# Altium schematic sheet USB_POWER.SchDoc
size Letter; SheetNumber: 12; SheetTotal: 15
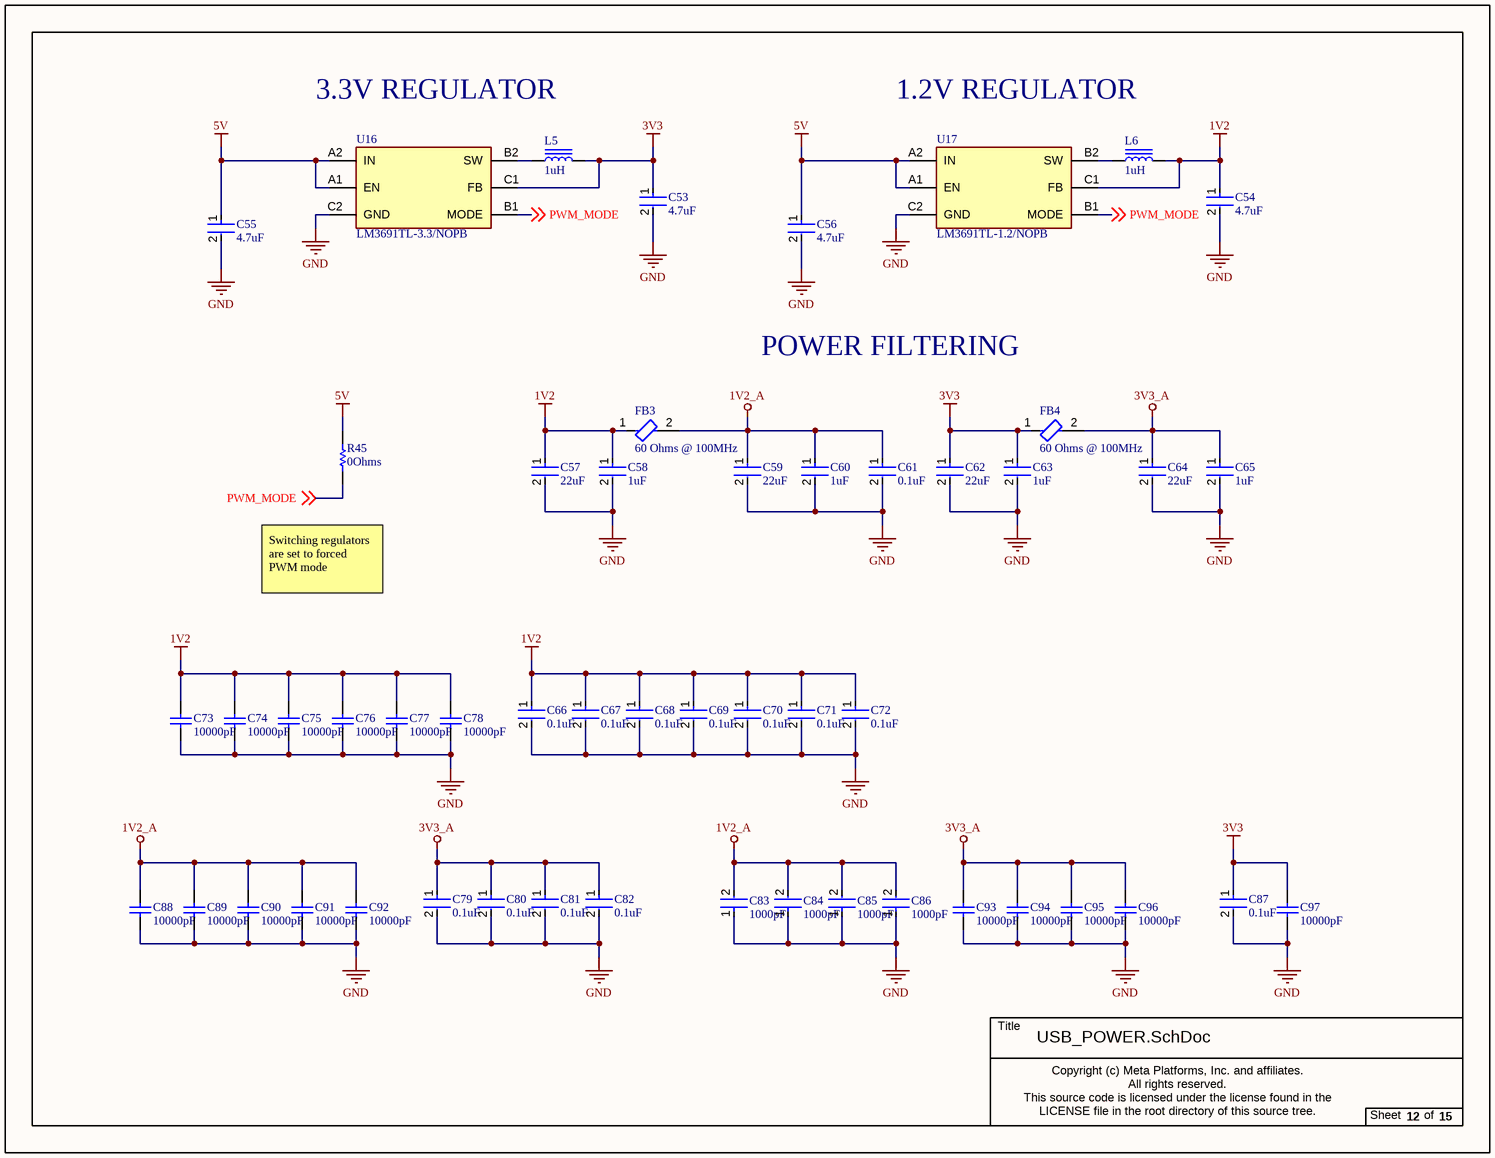
[diagram p0: USB_POWER.SchDoc]

## Parts
C53  4.7uF  [FP-CL828-IPC_C]
C54  4.7uF  [FP-CL828-IPC_C]
C55  4.7uF  [FP-CL828-IPC_C]
C56  4.7uF  [FP-CL828-IPC_C]
C57  22uF  [FP-CL05A226MQ5N6J8-IPC_C]
C58  1uF  [FP-CL511-IPC_C]
C59  22uF  [FP-CL05A226MQ5N6J8-IPC_C]
C60  1uF  [FP-CL511-IPC_C]
C61  0.1uF  [FP-CC0201-BA-MFG]
C62  22uF  [FP-CL05A226MQ5N6J8-IPC_C]
C63  1uF  [FP-CL511-IPC_C]
C64  22uF  [FP-CL05A226MQ5N6J8-IPC_C]
C65  1uF  [FP-CL511-IPC_C]
C66  0.1uF  [FP-CC0201-BA-MFG]
C67  0.1uF  [FP-CC0201-BA-MFG]
C68  0.1uF  [FP-CC0201-BA-MFG]
C69  0.1uF  [FP-CC0201-BA-MFG]
C70  0.1uF  [FP-CC0201-BA-MFG]
C71  0.1uF  [FP-CC0201-BA-MFG]
C72  0.1uF  [FP-CC0201-BA-MFG]
C73  10000pF  [CAPC1005X55X25LL05T10]
C74  10000pF  [CAPC1005X55X25LL05T10]
C75  10000pF  [CAPC1005X55X25LL05T10]
C76  10000pF  [CAPC1005X55X25LL05T10]
C77  10000pF  [CAPC1005X55X25LL05T10]
C78  10000pF  [CAPC1005X55X25LL05T10]
C79  0.1uF  [FP-CC0201-BA-MFG]
C80  0.1uF  [FP-CC0201-BA-MFG]
C81  0.1uF  [FP-CC0201-BA-MFG]
C82  0.1uF  [FP-CC0201-BA-MFG]
C83  1000pF  [FP-C0402-BB-MFG]
C84  1000pF  [FP-C0402-BB-MFG]
C85  1000pF  [FP-C0402-BB-MFG]
C86  1000pF  [FP-C0402-BB-MFG]
C87  0.1uF  [FP-CC0201-BA-MFG]
C88  10000pF  [CAPC1005X55X25LL05T10]
C89  10000pF  [CAPC1005X55X25LL05T10]
C90  10000pF  [CAPC1005X55X25LL05T10]
C91  10000pF  [CAPC1005X55X25LL05T10]
C92  10000pF  [CAPC1005X55X25LL05T10]
C93  10000pF  [CAPC1005X55X25LL05T10]
C94  10000pF  [CAPC1005X55X25LL05T10]
C95  10000pF  [CAPC1005X55X25LL05T10]
C96  10000pF  [CAPC1005X55X25LL05T10]
C97  10000pF  [CAPC1005X55X25LL05T10]
FB3  60 Ohms @ 100MHz  [FP-BLM15-0_05-d0_7-IPC_B]
FB4  60 Ohms @ 100MHz  [FP-BLM15-0_05-d0_7-IPC_B]
L5  1uH  [IND 0603_1608 RF WW]
L6  1uH  [IND 0603_1608 RF WW]
R45  0Ohms  [RESC1005X40X25ML05T10]
U16  LM3691TL-3.3/NOPB  [YZR0006APAF]
U17  LM3691TL-1.2/NOPB  [YZR0006APAF]

## Nets
1V2: C54.1 C57.1 C58.1 C66.1 C67.1 C68.1 C69.1 C70.1 C71.1 C72.1 C73.2 C74.2 C75.2 C76.2 C77.2 C78.2 FB3.1 L6.2 U17.C1(FB)
1V2_A: C59.1 C60.1 C61.1 C83.2 C84.2 C85.2 C86.2 C88.2 C89.2 C90.2 C91.2 C92.2 FB3.2
3V3: C53.1 C62.1 C63.1 C87.1 C97.2 FB4.1 L5.2 U16.C1(FB)
3V3_A: C64.1 C65.1 C79.1 C80.1 C81.1 C82.1 C93.2 C94.2 C95.2 C96.2 FB4.2
5V: C55.1 C56.1 R45.1 U16.A1(EN) U16.A2(IN) U17.A1(EN) U17.A2(IN)
GND: C53.2 C54.2 C55.2 C56.2 C57.2 C58.2 C59.2 C60.2 C61.2 C62.2 C63.2 C64.2 C65.2 C66.2 C67.2 C68.2 C69.2 C70.2 C71.2 C72.2 C73.1 C74.1 C75.1 C76.1 C77.1 C78.1 C79.2 C80.2 C81.2 C82.2 C83.1 C84.1 C85.1 C86.1 C87.2 C88.1 C89.1 C90.1 C91.1 C92.1 C93.1 C94.1 C95.1 C96.1 C97.1 U16.C2(GND) U17.C2(GND)
PWM_MODE: R45.2 U16.B1(MODE) U17.B1(MODE) ; off-sheet PWM_MODE
NetL5_1: L5.1 U16.B2(SW)
NetL6_1: L6.1 U17.B2(SW)

## Notes on the sheet
- 3.3V REGULATOR
- 1.2V REGULATOR
- POWER FILTERING
- Switching regulators
  are set to forced PWM mode
- Title
- Copyright (c) Meta Platforms, Inc. and affiliates.
  All rights reserved.
  This source code is licensed under the license found in the
  LICENSE file in the root directory of this source tree.
- Sheet
- of

## Library data of the parts
C53-C56 = CMP-13271-001251-1: Cap Ceramic 4.7uF 10V X5R ±10% SMD 0402 +85°C Paper T/R; Height: 0.5mm; Mount: Surface Mount; Case Code (Metric): 1005; Case/Package: 0402; Capacitance: 4.7uF; Packaging: Tape and Reel; Dielectric: X5R; Radiation Hardening: No; Material: Ceramic; Thickness: 0.022inch; Min Operating Temperature: -55°C; Voltage Rating: 10V; Case Code (Imperial): 0402; Width: 0.02inch; Length: 1mm; Max Operating Temperature: 85°C; Lead Free: Lead Free; Tolerance: 10%; Package Quantity: 1; Depth: 0.5mm
C57 C59 C62 C64 = CMP-13271-000001-1: CAP CER 22UF 6.3V X5R 0402; Manufacturer Part Number: CL05A226MQ5N6J8; Manufacturer: Samsung Electro-Mechanics; Material: Ceramic; Temperature Coefficient: 15%; Tolerance: 20%; Ipc Land Pattern Name: CAPC10050X50; Lead Free: Yes; Temperature Characteristic: X5R; Temperature: -55°C to +85°C; RoHS: TRUE; ComponentLink2Description: Datasheet; Device Class L3: Ceramic Capacitors; Device Class L1: Passive Components; Value: 22uF; Temperature Range High: +85°C; Automotive: No; Voltage Rating: 6.3V; Package: 0402; Category: Cap; Device Class L2: Capacitors; Height: 0.55mm; ComponentLink2URL: http://www.samsungsem.com/kr/support/library/product-catalog/__icsFiles/afieldfile/2018/11/28/MLCC.pdf; Temperature Range Low: -55°C; Octopart: https://octopart.com/cl05a226mq5n6j8-samsung-82337113; Capacitance: 22uF; Digikey Description: CAP CER 22UF 6.3V X5R 0402
C58 C60 C63 C65 = CMP-13271-001936-1: Cap Ceramic 1uF 10V X5R ±10% SMD 0402 +85°C Paper T/R; Depth: 0.5mm; Case Code (Imperial): 0402; Material: Ceramic; Mount: Surface Mount; Thickness: 0.022inch; Dielectric: X5R; Capacitance: 1uF; Radiation Hardening: No; Case/Package: 0402; Length: 1mm; Tolerance: 10%; Max Operating Temperature: 85°C; Package Quantity: 1; Width: 0.02inch; Voltage Rating: 10V; Contact Plating: Tin; Height: 0.5mm; Min Operating Temperature: -55°C; Case Code (Metric): 1005; Packaging: Tape and Reel
C61 C66-C72 C79-C82 C87 = CMP-03422-000376-1: CAP CER 0.1UF 6.3V X5R 0201; Manufacturer: Yageo; Manufacturer Part Number: CC0201KRX5R5BB104; Tolerance: 0.1; Temperature Coefficient: 15%; Value: 100 nF; Material: Ceramic; Automotive: No; Device Class L2: Capacitors; Temperature Range High: +85°C; Capacitance: 100 nF; Temperature: -55°C to +85°C; ComponentLink2URL: http://www.yageo.com/documents/recent/UPY-GPHC_X5R_4V-to-50V_25.pdf; Category: Cap; Mouser Description: Multilayer Ceramic Capacitors MLCC - SMD/SMT 100nF 6.3V X5R 10%; Ipc Land Pattern Name: CAPC6030X30; Temperature Characteristic: X5R; Voltage Rating: 6.3 V; Lead Free: Yes; Digikey Description: CAP CER 0.1UF 6.3V X5R 0201; Device Class L1: Passive Components; Octopart: https://octopart.com/cc0201krx5r5bb104-yageo-9292636; Height: 0.33mm; Package: CC0201-BA; Footprint Url: http://www.yageo.com/exep/pages/download/literatures/UPY-C_GEN_24.pdf; ComponentLink2Description: Datasheet; Device Class L3: Ceramic Capacitors; Temperature Range Low: -55°C; RoHS: TRUE
C73-C78 C88-C97 = CMP-1034-01880-2: Manufacturer: Murata; Part Number: GRM155R71E103KA01D
C83-C86 = CMP-2008-03060-3: Cap Ceramic 0.001uF 50V X7R 10% SMD 0402 125°C Paper T/R (Alt: C0402C102K5RACTU); Manufacturer: Kemet; Capacitance: 1,000 pF; Value: 1,000 pF; Tolerance: 0.1; Temperature Coefficient: 15%; Height: 0.55mm; ComponentLink2URL: https://content.kemet.com/datasheets/KEM_C1002_X7R_SMD.pdf; Temperature Range High: +125°C; Package: C0402-BB; Device Class L3: Ceramic Capacitors; Temperature Characteristic: X7R; Mouser Description: Cap Ceramic 0.001uF 50V X7R 10% SMD 0402 125°C Paper T/R (Alt: C0402C102K5RACTU); Octopart: https://octopart.com/c0402c102k5ractu-kemet-100678; Temperature Range Low: -55°C; ComponentLink2Description: Datasheet; Material: Ceramic; RoHS: TRUE; Lead Free: Yes; Device Class L1: Passive Components; Digikey Description: Cap Ceramic 0.001uF 50V X7R 10% SMD 0402 125°C Paper T/R (Alt: C0402C102K5RACTU); Voltage Rating: 50 V; Automotive: No; Ipc Land Pattern Name: CAPC10050X50; Temperature: -55°C to +125°C; Category: Cap; Manufacturer Part Number: C0402C102K5RACTU; Device Class L2: Capacitors
FB3 FB4 = CMP-0686-00129-3: Chip Ferrite Bead, 0402, 60Ω @ 100MHz, 0.06Ω, 25%, 1.7A; Number of Circuits: 1; DC Resistance (DCR): 60mR; Material: Steel; Impedance: 60R; Test Frequency: 100MHz; Lead Free: Lead Free; Radiation Hardening: No; Min Operating Temperature: -55°C; Case Code (Metric): 1005; Series: BLM15PD; Max Current Rating: 1.7A; Length: 1mm; Tolerance: 25%; Current Rating: 1.7A; RoHS Compliant: Yes; DC Current: 1.7A; Width: 0.5mm; Core Material: Ferrite; Number of Pins: 2; Depth: 0.55mm; Case Code (Imperial): 0402; Number of Lines: 1; Package Quantity: 1; Max Operating Temperature: 125°C; Case/Package: 0402; Termination: SMD/SMT; Packaging: Tape and Reel; Height: 0.5mm; Military Standard: Not; REACH SVHC: No SVHC; Max DC Current: 1.7A; DC Resistance-Max: 60MR
L5 L6 = MCHK1608T1R0MKN: SMT Inductor; Manufacturer: Taiyo Yuden; Part Number: MCHK1608T1R0MKN; Value: 1uH
R45 = CMP-2002-03043-1: Part Number: CRCW040210K0FKEDHP; Manufacturer: Vishay Dale
U16 = LM3691TL-3.3/NOPB: Buck Switching Regulator IC Positive Fixed 3.3V 1 Output 1A 6-WFBGA, DSBGA; Manufacturer: Texas Instruments; Part Number: LM3691TL-3.3/NOPB
U17 = LM3691TL-1.2/NOPB: Buck Switching Regulator IC Positive Fixed 1.2V 1 Output 1A 6-WFBGA, DSBGA; Manufacturer: Texas Instruments; Part Number: LM3691TL-1.2/NOPB